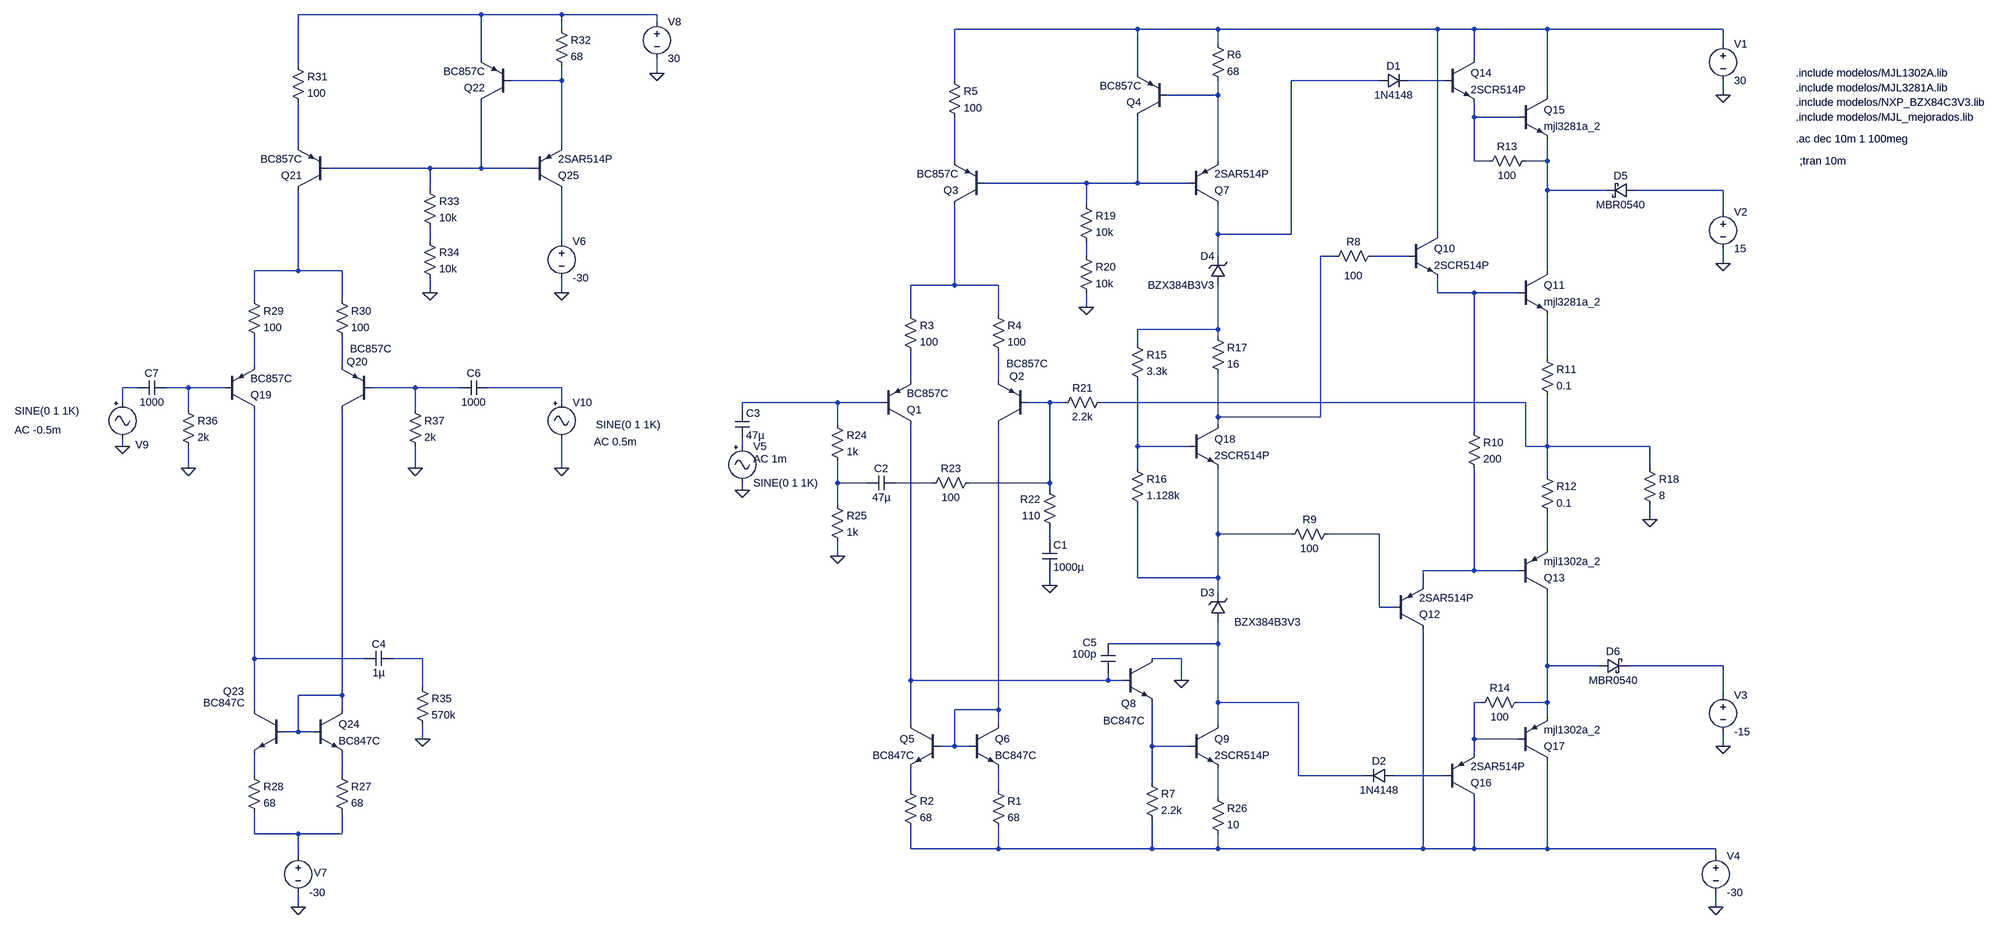
[diagram p0: schematic tp_final_amplificador_resp_frec.asc]
tp_final_amplificador_resp_frec.asc, the LTspice schematic file:
Version 4
SHEET 1 1852 948
WIRE -2000 -1024 -2400 -1024
WIRE -1824 -1024 -2000 -1024
WIRE -1616 -1024 -1824 -1024
WIRE -1616 -1008 -1616 -1024
WIRE -1824 -992 -1824 -1024
WIRE -320 -992 -720 -992
WIRE -144 -992 -320 -992
WIRE 336 -992 -144 -992
WIRE 416 -992 336 -992
WIRE 576 -992 416 -992
WIRE 960 -992 576 -992
WIRE -144 -960 -144 -992
WIRE 960 -960 960 -992
WIRE -2000 -928 -2000 -1024
WIRE 416 -928 416 -992
WIRE -2400 -912 -2400 -1024
WIRE -1616 -896 -1616 -928
WIRE -320 -896 -320 -992
WIRE -1824 -880 -1824 -912
WIRE -1824 -880 -1936 -880
WIRE -720 -880 -720 -992
WIRE 208 -880 16 -880
WIRE 352 -880 272 -880
WIRE -144 -848 -144 -880
WIRE -144 -848 -256 -848
WIRE 576 -848 576 -992
WIRE 960 -848 960 -880
WIRE 416 -800 416 -832
WIRE 512 -800 416 -800
WIRE -2400 -736 -2400 -832
WIRE -1824 -736 -1824 -880
WIRE -720 -704 -720 -800
WIRE -144 -704 -144 -848
WIRE 416 -704 416 -800
WIRE 448 -704 416 -704
WIRE 576 -704 576 -752
WIRE 576 -704 528 -704
WIRE -2112 -688 -2336 -688
WIRE -2000 -688 -2000 -832
WIRE -2000 -688 -2112 -688
WIRE -1888 -688 -2000 -688
WIRE -432 -656 -656 -656
WIRE -320 -656 -320 -800
WIRE -320 -656 -432 -656
WIRE -208 -656 -320 -656
WIRE -2112 -640 -2112 -688
WIRE 576 -640 576 -704
WIRE 704 -640 576 -640
WIRE 960 -640 768 -640
WIRE -432 -608 -432 -656
WIRE 960 -592 960 -640
WIRE -144 -544 -144 -608
WIRE 16 -544 16 -880
WIRE 16 -544 -144 -544
WIRE 336 -544 336 -992
WIRE -2112 -528 -2112 -560
WIRE -1824 -528 -1824 -640
WIRE -432 -496 -432 -528
WIRE -144 -496 -144 -544
WIRE 112 -496 80 -496
WIRE 272 -496 192 -496
WIRE 960 -480 960 -512
WIRE -2400 -464 -2400 -640
WIRE -2400 -464 -2496 -464
WIRE -2304 -464 -2400 -464
WIRE 576 -464 576 -640
WIRE -720 -432 -720 -608
WIRE -720 -432 -816 -432
WIRE -624 -432 -720 -432
WIRE -2112 -416 -2112 -448
WIRE -1824 -416 -1824 -448
WIRE 336 -416 336 -448
WIRE 416 -416 336 -416
WIRE 512 -416 416 -416
WIRE -2496 -400 -2496 -464
WIRE -2304 -400 -2304 -464
WIRE -432 -384 -432 -416
WIRE -816 -368 -816 -432
WIRE -624 -368 -624 -432
WIRE -144 -336 -144 -432
WIRE -144 -336 -320 -336
WIRE -144 -320 -144 -336
WIRE -320 -304 -320 -336
WIRE 576 -272 576 -368
WIRE -2496 -256 -2496 -320
WIRE -2304 -256 -2304 -320
WIRE -816 -224 -816 -288
WIRE -624 -224 -624 -288
WIRE -2752 -208 -2784 -208
WIRE -2640 -208 -2688 -208
WIRE -2560 -208 -2640 -208
WIRE -2144 -208 -2240 -208
WIRE -2048 -208 -2144 -208
WIRE -1824 -208 -1984 -208
WIRE -2784 -176 -2784 -208
WIRE -1824 -176 -1824 -208
WIRE -976 -176 -1184 -176
WIRE -880 -176 -976 -176
WIRE -512 -176 -560 -176
WIRE -480 -176 -512 -176
WIRE 528 -176 -400 -176
WIRE -2640 -160 -2640 -208
WIRE -2144 -160 -2144 -208
WIRE -1184 -160 -1184 -176
WIRE -144 -144 -144 -240
WIRE 80 -144 80 -496
WIRE 80 -144 -144 -144
WIRE -976 -128 -976 -176
WIRE -144 -128 -144 -144
WIRE 416 -112 416 -416
WIRE -2784 -80 -2784 -96
WIRE -1184 -80 -1184 -96
WIRE -320 -80 -320 -224
WIRE -208 -80 -320 -80
WIRE 528 -80 528 -176
WIRE 576 -80 576 -192
WIRE 576 -80 528 -80
WIRE 800 -80 576 -80
WIRE -2640 -32 -2640 -80
WIRE -2144 -32 -2144 -80
WIRE -1824 -32 -1824 -96
WIRE -320 -32 -320 -80
WIRE 800 -32 800 -80
WIRE 576 -16 576 -80
WIRE -976 0 -976 -48
WIRE -912 0 -976 0
WIRE -768 0 -848 0
WIRE -512 0 -512 -176
WIRE -512 0 -688 0
WIRE -1184 16 -1184 0
WIRE -512 16 -512 0
WIRE -976 48 -976 0
WIRE 800 80 800 48
WIRE -144 112 -144 -32
WIRE 16 112 -144 112
WIRE 208 112 96 112
WIRE -512 128 -512 96
WIRE 576 144 576 64
WIRE -976 160 -976 128
WIRE 416 192 416 -32
WIRE 416 192 304 192
WIRE 512 192 416 192
WIRE -320 208 -320 48
WIRE -144 208 -144 112
WIRE -144 208 -320 208
WIRE -512 224 -512 192
WIRE 304 224 304 192
WIRE -144 240 -144 208
WIRE 208 272 208 112
WIRE 240 272 208 272
WIRE -144 352 -144 304
WIRE -144 352 -384 352
WIRE -2496 384 -2496 -160
WIRE -2256 384 -2496 384
WIRE -2128 384 -2192 384
WIRE -224 384 -288 384
WIRE 576 400 576 240
WIRE 688 400 576 400
WIRE 960 400 752 400
WIRE -816 432 -816 -128
WIRE -384 432 -384 416
WIRE -384 432 -816 432
WIRE -352 432 -384 432
WIRE -224 432 -224 384
WIRE -2128 448 -2128 384
WIRE -2304 464 -2304 -160
WIRE -2304 464 -2400 464
WIRE 960 464 960 400
WIRE -144 480 -144 352
WIRE 32 480 -144 480
WIRE 432 480 416 480
WIRE 576 480 576 400
WIRE 576 480 512 480
WIRE -2496 496 -2496 384
WIRE -2304 496 -2304 464
WIRE -624 496 -624 -128
WIRE -624 496 -720 496
WIRE 576 512 576 480
WIRE -816 528 -816 432
WIRE -624 528 -624 496
WIRE -144 528 -144 480
WIRE -2400 544 -2400 464
WIRE -2400 544 -2432 544
WIRE -2368 544 -2400 544
WIRE -2128 560 -2128 528
WIRE 416 560 416 480
WIRE 512 560 416 560
WIRE -720 576 -720 496
WIRE -720 576 -752 576
WIRE -688 576 -720 576
WIRE -288 576 -288 480
WIRE -208 576 -288 576
WIRE 960 576 960 544
WIRE 416 592 416 560
WIRE -2496 640 -2496 592
WIRE -2304 640 -2304 592
WIRE 32 640 32 480
WIRE 176 640 32 640
WIRE 352 640 240 640
WIRE -288 656 -288 576
WIRE -816 672 -816 624
WIRE -624 672 -624 624
WIRE -144 688 -144 624
WIRE -2496 768 -2496 720
WIRE -2400 768 -2496 768
WIRE -2304 768 -2304 720
WIRE -2304 768 -2400 768
WIRE -816 800 -816 752
WIRE -624 800 -624 752
WIRE -624 800 -816 800
WIRE -288 800 -288 736
WIRE -288 800 -624 800
WIRE -144 800 -144 768
WIRE -144 800 -288 800
WIRE 304 800 304 320
WIRE 304 800 -144 800
WIRE 416 800 416 688
WIRE 416 800 304 800
WIRE 576 800 576 608
WIRE 576 800 416 800
WIRE 944 800 576 800
WIRE -2400 816 -2400 768
WIRE 944 816 944 800
WIRE -2400 928 -2400 896
WIRE 944 928 944 896
FLAG -224 432 0
FLAG 800 80 0
FLAG 944 928 0
FLAG 960 576 0
FLAG 960 -480 0
FLAG 960 -848 0
FLAG -432 -384 0
FLAG -512 224 0
FLAG -976 160 0
FLAG -1184 16 0
FLAG -2112 -416 0
FLAG -1824 -416 0
FLAG -2400 928 0
FLAG -1616 -896 0
FLAG -2128 560 0
FLAG -1824 -32 0
FLAG -2784 -80 0
FLAG -2640 -32 0
FLAG -2144 -32 0
SYMBOL pnp -880 -128 M180
SYMATTR InstName Q1
SYMATTR Value BC857C
SYMBOL pnp -560 -128 R180
WINDOW 0 8 105 Left 2
WINDOW 3 -44 133 Left 2
SYMATTR InstName Q2
SYMATTR Value BC857C
SYMBOL pnp -656 -608 R180
SYMATTR InstName Q3
SYMATTR Value BC857C
SYMBOL pnp -256 -800 R180
SYMATTR InstName Q4
SYMATTR Value BC857C
SYMBOL npn -752 528 M0
SYMATTR InstName Q5
SYMATTR Value BC847C
SYMBOL npn -688 528 R0
SYMATTR InstName Q6
SYMATTR Value BC847C
SYMBOL res -640 656 R0
SYMATTR InstName R1
SYMATTR Value 68
SYMBOL res -832 656 R0
SYMATTR InstName R2
SYMATTR Value 68
SYMBOL res -832 -384 R0
SYMATTR InstName R3
SYMATTR Value 100
SYMBOL res -640 -384 R0
SYMATTR InstName R4
SYMATTR Value 100
SYMBOL res -736 -896 R0
SYMATTR InstName R5
SYMATTR Value 100
SYMBOL res -160 -976 R0
SYMATTR InstName R6
SYMATTR Value 68
SYMBOL pnp -208 -608 M180
SYMATTR InstName Q7
SYMATTR Value 2SAR514P
SYMBOL npn -352 384 R0
WINDOW 0 -4 99 Left 2
WINDOW 3 -43 136 Left 2
SYMATTR InstName Q8
SYMATTR Value BC847C
SYMBOL npn -208 528 R0
SYMATTR InstName Q9
SYMATTR Value 2SCR514P
SYMBOL res -304 640 R0
SYMATTR InstName R7
SYMATTR Value 2.2k
SYMBOL res 208 -512 R90
WINDOW 0 0 56 VBottom 2
WINDOW 3 43 56 VTop 2
SYMATTR InstName R8
SYMATTR Value 100
SYMBOL res 112 96 R90
WINDOW 0 0 56 VBottom 2
WINDOW 3 32 56 VTop 2
SYMATTR InstName R9
SYMATTR Value 100
SYMBOL npn 272 -544 R0
SYMATTR InstName Q10
SYMATTR Value 2SCR514P
SYMBOL npn 512 -464 R0
SYMATTR InstName Q11
SYMATTR Value mjl3281a_2
SYMBOL pnp 240 320 M180
SYMATTR InstName Q12
SYMATTR Value 2SAR514P
SYMBOL pnp 512 240 M180
SYMATTR InstName Q13
SYMATTR Value mjl1302a_2
SYMBOL res 400 -128 R0
SYMATTR InstName R10
SYMATTR Value 200
SYMBOL res 560 -288 R0
SYMATTR InstName R11
SYMATTR Value 0.1
SYMBOL res 560 -32 R0
SYMATTR InstName R12
SYMATTR Value 0.1
SYMBOL npn 352 -928 R0
SYMATTR InstName Q14
SYMATTR Value 2SCR514P
SYMBOL npn 512 -848 R0
SYMATTR InstName Q15
SYMATTR Value mjl3281a_2
SYMBOL res 544 -720 R90
WINDOW 0 0 56 VBottom 2
WINDOW 3 32 56 VTop 2
SYMATTR InstName R13
SYMATTR Value 100
SYMBOL diode 208 -864 R270
WINDOW 0 32 32 VTop 2
WINDOW 3 0 32 VBottom 2
SYMATTR InstName D1
SYMATTR Value 1N4148
SYMBOL diode 240 624 R90
WINDOW 0 0 32 VBottom 2
WINDOW 3 32 32 VTop 2
SYMATTR InstName D2
SYMATTR Value 1N4148
SYMBOL pnp 352 688 M180
SYMATTR InstName Q16
SYMATTR Value 2SAR514P
SYMBOL pnp 512 608 M180
SYMATTR InstName Q17
SYMATTR Value mjl1302a_2
SYMBOL res 528 464 R90
WINDOW 0 0 56 VBottom 2
WINDOW 3 32 56 VTop 2
SYMATTR InstName R14
SYMATTR Value 100
SYMBOL zener -128 304 R180
WINDOW 0 24 64 Left 2
WINDOW 3 -165 0 Left 2
SYMATTR InstName D3
SYMATTR Value BZX384B3V3
SYMBOL npn -208 -128 R0
SYMATTR InstName Q18
SYMATTR Value 2SCR514P
SYMBOL res -336 -320 R0
SYMATTR InstName R15
SYMATTR Value 3.3k
SYMBOL res -336 -48 R0
SYMATTR InstName R16
SYMATTR Value 1.128k
SYMBOL res -160 -336 R0
SYMATTR InstName R17
SYMATTR Value 16
SYMBOL zener -128 -432 R180
WINDOW 0 24 64 Left 2
WINDOW 3 24 0 Left 2
SYMATTR InstName D4
SYMATTR Value BZX384B3V3
SYMBOL res 784 -48 R0
SYMATTR InstName R18
SYMATTR Value 8
SYMBOL schottky 768 -656 R90
WINDOW 0 0 32 VBottom 2
WINDOW 3 32 32 VTop 2
SYMATTR InstName D5
SYMATTR Value MBR0540
SYMATTR Description Diode
SYMATTR Type diode
SYMBOL schottky 688 416 R270
WINDOW 0 32 32 VTop 2
WINDOW 3 0 32 VBottom 2
SYMATTR InstName D6
SYMATTR Value MBR0540
SYMATTR Description Diode
SYMATTR Type diode
SYMBOL voltage 960 -976 R0
WINDOW 123 0 0 Left 0
WINDOW 39 0 0 Left 0
SYMATTR InstName V1
SYMATTR Value 30
SYMBOL voltage 960 -608 R0
WINDOW 123 0 0 Left 0
WINDOW 39 0 0 Left 0
SYMATTR InstName V2
SYMATTR Value 15
SYMBOL voltage 960 448 R0
WINDOW 123 0 0 Left 0
WINDOW 39 0 0 Left 0
SYMATTR InstName V3
SYMATTR Value -15
SYMBOL voltage 944 800 R0
WINDOW 123 0 0 Left 0
WINDOW 39 0 0 Left 0
SYMATTR InstName V4
SYMATTR Value -30
SYMBOL res -448 -624 R0
SYMATTR InstName R19
SYMATTR Value 10k
SYMBOL res -448 -512 R0
SYMATTR InstName R20
SYMATTR Value 10k
SYMBOL res -384 -192 R90
WINDOW 0 0 56 VBottom 2
WINDOW 3 32 56 VTop 2
SYMATTR InstName R21
SYMATTR Value 2.2k
SYMBOL res -496 112 R180
WINDOW 0 36 76 Left 2
WINDOW 3 36 40 Left 2
SYMATTR InstName R22
SYMATTR Value 110
SYMBOL cap -528 128 R0
SYMATTR InstName C1
SYMATTR Value 1000µ
SYMBOL res -672 -16 R90
WINDOW 0 0 56 VBottom 2
WINDOW 3 32 56 VTop 2
SYMATTR InstName R23
SYMATTR Value 100
SYMBOL cap -848 -16 R90
WINDOW 0 0 32 VBottom 2
WINDOW 3 32 32 VTop 2
SYMATTR InstName C2
SYMATTR Value 47µ
SYMBOL res -992 -144 R0
SYMATTR InstName R24
SYMATTR Value 1k
SYMBOL res -992 32 R0
SYMATTR InstName R25
SYMATTR Value 1k
SYMBOL cap -1200 -160 R0
SYMATTR InstName C3
SYMATTR Value 47µ
SYMBOL res -160 672 R0
SYMATTR InstName R26
SYMATTR Value 10
SYMBOL cap -400 352 R0
WINDOW 0 -40 -3 Left 2
WINDOW 3 -63 22 Left 2
SYMATTR InstName C5
SYMATTR Value 100p
SYMBOL Misc\\signal -1184 -96 R0
WINDOW 123 24 44 Left 2
WINDOW 39 0 0 Left 0
SYMATTR Value2 AC 1m
SYMATTR InstName V5
SYMBOL pnp -2560 -160 M180
SYMATTR InstName Q19
SYMATTR Value BC857C
SYMBOL pnp -2240 -160 R180
WINDOW 0 8 105 Left 2
WINDOW 3 -44 133 Left 2
SYMATTR InstName Q20
SYMATTR Value BC857C
SYMBOL pnp -2336 -640 R180
SYMATTR InstName Q21
SYMATTR Value BC857C
SYMBOL pnp -1936 -832 R180
SYMATTR InstName Q22
SYMATTR Value BC857C
SYMBOL npn -2432 496 M0
WINDOW 0 86 -40 Left 2
WINDOW 3 85 -15 Left 2
SYMATTR InstName Q23
SYMATTR Value BC847C
SYMBOL npn -2368 496 R0
SYMATTR InstName Q24
SYMATTR Value BC847C
SYMBOL res -2320 624 R0
SYMATTR InstName R27
SYMATTR Value 68
SYMBOL res -2512 624 R0
SYMATTR InstName R28
SYMATTR Value 68
SYMBOL res -2512 -416 R0
SYMATTR InstName R29
SYMATTR Value 100
SYMBOL res -2320 -416 R0
SYMATTR InstName R30
SYMATTR Value 100
SYMBOL res -2416 -928 R0
SYMATTR InstName R31
SYMATTR Value 100
SYMBOL res -1840 -1008 R0
SYMATTR InstName R32
SYMATTR Value 68
SYMBOL pnp -1888 -640 M180
SYMATTR InstName Q25
SYMATTR Value 2SAR514P
SYMBOL res -2128 -656 R0
SYMATTR InstName R33
SYMATTR Value 10k
SYMBOL res -2128 -544 R0
SYMATTR InstName R34
SYMATTR Value 10k
SYMBOL voltage -1824 -544 R0
WINDOW 123 0 0 Left 0
WINDOW 39 0 0 Left 0
SYMATTR InstName V6
SYMATTR Value -30
SYMBOL voltage -2400 800 R0
WINDOW 123 0 0 Left 0
WINDOW 39 0 0 Left 0
WINDOW 0 34 53 Left 2
SYMATTR InstName V7
SYMATTR Value -30
SYMBOL voltage -1616 -1024 R0
WINDOW 123 0 0 Left 0
WINDOW 39 0 0 Left 0
SYMATTR InstName V8
SYMATTR Value 30
SYMBOL cap -2192 368 R90
WINDOW 0 0 32 VBottom 2
WINDOW 3 32 32 VTop 2
SYMATTR InstName C4
SYMATTR Value 1µ
SYMBOL res -2144 432 R0
SYMATTR InstName R35
SYMATTR Value 570k
SYMBOL Misc\\signal -2784 -192 R0
WINDOW 0 28 109 Left 2
WINDOW 3 -236 35 Left 2
WINDOW 123 -236 76 Left 2
WINDOW 39 0 0 Left 0
SYMATTR InstName V9
SYMATTR Value2 AC -0.5m
SYMBOL Misc\\signal -1824 -192 R0
WINDOW 3 75 65 Left 2
WINDOW 123 71 102 Left 2
WINDOW 39 0 0 Left 0
SYMATTR Value2 AC 0.5m
SYMATTR InstName V10
SYMBOL res -2656 -176 R0
SYMATTR InstName R36
SYMATTR Value 2k
SYMBOL res -2160 -176 R0
SYMATTR InstName R37
SYMATTR Value 2k
SYMBOL cap -1984 -224 R90
WINDOW 0 0 32 VBottom 2
WINDOW 3 32 32 VTop 2
SYMATTR InstName C6
SYMATTR Value 1000
SYMBOL cap -2688 -224 R90
WINDOW 0 0 32 VBottom 2
WINDOW 3 32 32 VTop 2
SYMATTR InstName C7
SYMATTR Value 1000
TEXT 1416 -896 Left 2 !.include modelos/MJL1302A.lib
TEXT 1416 -864 Left 2 !.include modelos/MJL3281A.lib
TEXT 1416 -832 Left 2 !.include modelos/NXP_BZX84C3V3.lib
TEXT 1416 -752 Left 2 !.ac dec 10m 1 100meg
TEXT 1424 -704 Left 2 !;tran 10m
TEXT 1416 -800 Left 2 !.include modelos/MJL_mejorados.lib

The netlist it stands for:
* tp_final_amplificador_resp_frec.asc
Q1 N049 N032 N026 0 BC857C
Q2 N052 N033 N027 0 BC857C
Q3 N020 N012 N009 0 BC857C
Q4 N012 N006 N002 0 BC857C
Q5 N049 N052 N057 0 BC847C
Q6 N052 N052 N058 0 BC847C
R1 N058 N061 68
R2 N057 N061 68
R3 N020 N026 100
R4 N020 N027 100
R5 N002 N009 100
R6 N002 N006 68
Q7 N004 N012 N006 0 2SAR514P
Q8 0 N049 N053 0 BC847C
Q9 N044 N053 N059 0 2SCR514P
R7 N053 N061 2.2k
R8 N018 N017 100
R9 N040 N039 100
Q10 N002 N018 N021 0 2SCR514P
Q11 N010 N021 N023 0 mjl3281a_2
Q12 N061 N040 N043 0 2SAR514P
Q13 N047 N043 N042 0 mjl1302a_2
R10 N021 N043 200
R11 N023 N034 0.1
R12 N034 N042 0.1
Q14 N002 N005 N007 0 2SCR514P
Q15 N002 N007 N010 0 mjl3281a_2
R13 N010 N007 100
D1 N004 N005 1N4148
D2 N056 N044 1N4148
Q16 N061 N056 N051 0 2SAR514P
Q17 N061 N051 N047 0 mjl1302a_2
R14 N047 N051 100
D3 N044 N039 BZX384B3V3
Q18 N017 N036 N039 0 2SCR514P
R15 N022 N036 3.3k
R16 N036 N039 1.128k
R17 N022 N017 16
D4 N022 N004 BZX384B3V3
R18 N034 0 8
D5 N013 N010 MBR0540
D6 N047 N048 MBR0540
V1 N002 0 30
V2 N013 0 15
V3 N048 0 -15
V4 N061 0 -30
R19 N012 N016 10k
R20 N016 0 10k
R21 N034 N033 2.2k
R22 N041 N033 110
C1 N041 0 1000µ
R23 N033 N038 100
C2 N038 N037 47µ
R24 N032 N037 1k
R25 N037 0 1k
C3 N032 N035 47µ
R26 N059 N061 10
C5 N044 N049 100p
V5 N035 0 SINE(0 1 1K) AC 1m
Q19 N045 N029 N024 0 BC857C
Q20 N050 N030 N025 0 BC857C
Q21 N019 N011 N008 0 BC857C
Q22 N011 N003 N001 0 BC857C
Q23 N045 N050 N054 0 BC847C
Q24 N050 N050 N055 0 BC847C
R27 N055 N060 68
R28 N054 N060 68
R29 N019 N024 100
R30 N019 N025 100
R31 N001 N008 100
R32 N001 N003 68
Q25 N015 N011 N003 0 2SAR514P
R33 N011 N014 10k
R34 N014 0 10k
V6 N015 0 -30
V7 N060 0 -30
V8 N001 0 30
C4 N046 N045 1µ
R35 N046 0 570k
V9 N028 0 SINE(0 1 1K) AC -0.5m
V10 N031 0 SINE(0 1 1K) AC 0.5m
R36 N029 0 2k
R37 N030 0 2k
C6 N031 N030 1000
C7 N029 N028 1000
.model D D
.lib standard.dio
.model NPN NPN
.model PNP PNP
.lib standard.bjt
.include modelos/MJL1302A.lib
.include modelos/MJL3281A.lib
.include modelos/NXP_BZX84C3V3.lib
.ac dec 10m 1 100meg
;tran 10m
.include modelos/MJL_mejorados.lib
.backanno
.end